# Altium schematic sheet sheet3.SchDoc
size A3
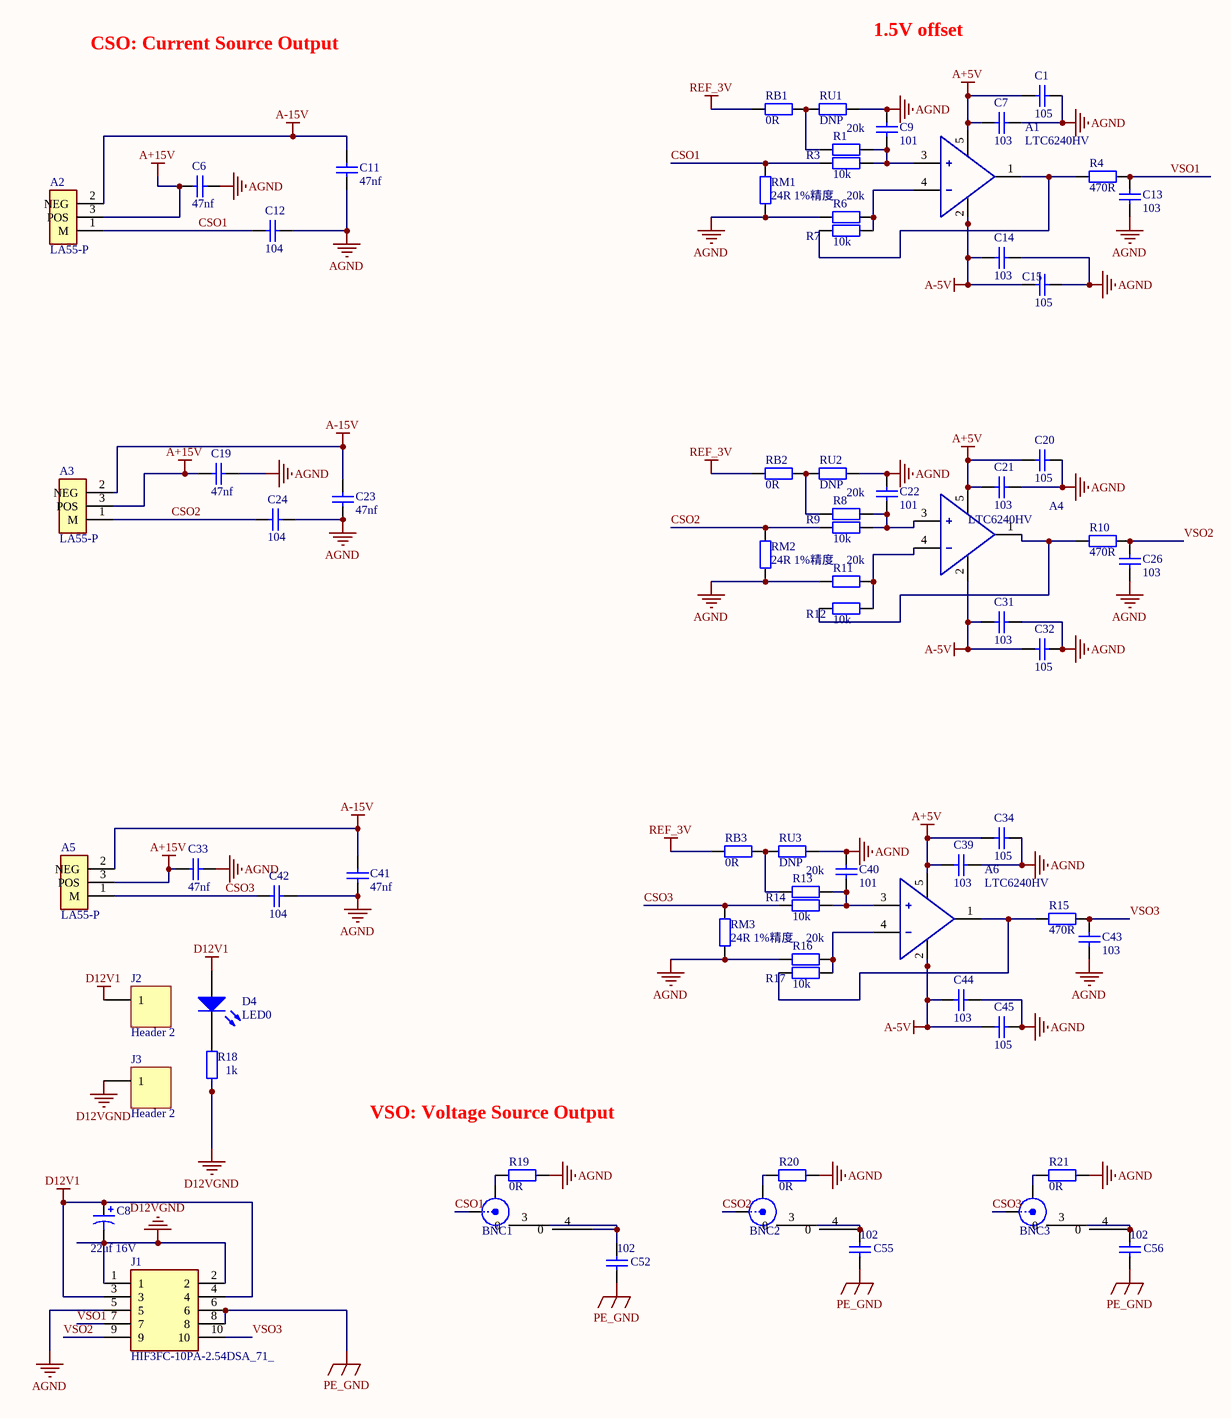
[diagram p0: sheet3.SchDoc]

## Parts
A1  LTC6240HV  [SOT95P280X100-5N]
A2  LA55-P  [XDCR_LA55-P]
A3  LA55-P  [XDCR_LA55-P]
A4  LTC6240HV  [SOT95P280X100-5N]
A5  LA55-P  [XDCR_LA55-P]
A6  LTC6240HV  [SOT95P280X100-5N]
BNC1  BNC  [BNC]  (value not drawn)
BNC2  BNC  [BNC]  (value not drawn)
BNC3  BNC  [BNC]  (value not drawn)
C1  105  [0805]
C6  47nf  [0805]
C7  103  [0805]
C8  22uf 16V  [1206 (钽电容)]
C9  101  [0805]
C11  47nf  [0805]
C12  104  [0805]
C13  103  [0805]
C14  103  [0805]
C15  105  [0805]
C19  47nf  [0805]
C20  105  [0805]
C21  103  [0805]
C22  101  [0805]
C23  47nf  [0805]
C24  104  [0805]
C26  103  [0805]
C31  103  [0805]
C32  105  [0805]
C33  47nf  [0805]
C34  105  [0805]
C39  103  [0805]
C40  101  [0805]
C41  47nf  [0805]
C42  104  [0805]
C43  103  [0805]
C44  103  [0805]
C45  105  [0805]
C52  102  [0805]
C55  102  [0805]
C56  102  [0805]
D4  LED0  [l0805]
J1  HIF3FC-10PA-2.54DSA_71_  [SHDR10W50P254_2X5_2020X850X920P]
J2  Header 2  [接地柱M3]
J3  Header 2  [接地柱M3]
R1  20k  [0805]
R3  10k  [0805]
R4  470R  [0805]
R6  20k  [0805]
R7  10k  [0805]
R8  20k  [0805]
R9  10k  [0805]
R10  470R  [0805]
R11  20k  [0805]
R12  10k  [0805]
R13  20k  [0805]
R14  10k  [0805]
R15  470R  [0805]
R16  20k  [0805]
R17  10k  [0805]
R18  1k  [0805]
R19  0R  [0805]
R20  0R  [0805]
R21  0R  [0805]
RB1  0R  [0805]
RB2  0R  [0805]
RB3  0R  [0805]
RM1  24R 1%精度  [2512]
RM2  24R 1%精度  [2512]
RM3  24R 1%精度  [2512]
RU1  DNP  [0805]
RU2  DNP  [0805]
RU3  DNP  [0805]

## Nets
A+5V: A1.5(Vcc) A4.5(Vcc) A6.5(Vcc) C1.2 C7.2 C20.2 C21.2 C34.2 C39.2
A+15V: A2.3(POS) A3.3(POS) A5.3(POS) C6.2 C19.2 C33.2
A-5V: A1.2(Vee) A4.2(Vee) A6.2(Vee) C14.2 C15.2 C31.2 C32.2 C44.2 C45.2
A-15V: A2.2(NEG) A3.2(NEG) A5.2(NEG) C11.2 C23.1 C41.1
AGND: C1.1 C6.1 C7.1 C9.2 C11.1 C12.2 C13.1 C14.1 C15.1 C19.1 C20.1 C21.1 C22.2 C23.2 C24.2 C26.1 C31.1 C32.1 C33.1 C34.1 C39.1 C40.2 C41.2 C42.2 C43.1 C44.1 C45.1 J1.5 R6.1 R11.1 R16.1 R19.1 R20.1 R21.1 RM1.2 RM2.2 RM3.2 RU1.2 RU2.2 RU3.2
D12V1: C8.1 D4.1(A) J1.3 J1.4 J2.1
D12VGND: C8.2 J1.1 J1.2 J3.1 R18.1
PE_GND: C52.2 C55.2 C56.2 J1.6 J1.8
REF_3V: RB1.1 RB2.1 RB3.1
CSO1: A2.1(M) BNC1.1(X) C12.1 R3.1 RM1.1
CSO2: A3.1(M) BNC2.1(X) C24.1 R9.1 RM2.1
CSO3: A5.1(M) BNC3.1(X) C42.1 R14.1 RM3.1
VSO1: C13.2 J1.7 R4.1
VSO2: C26.2 J1.9 R10.1
VSO3: C43.2 J1.10 R15.1
NetA1_1: A1.1(out) R4.2 R7.1
NetA1_3: A1.3(+IN) C9.1 R1.2 R3.2
NetA1_4: A1.4(-IN) R6.2 R7.2
NetA4_1: A4.1(out) R10.2 R12.1
NetA4_3: A4.3(+IN) C22.1 R8.2 R9.2
NetA4_4: A4.4(-IN) R11.2 R12.2
NetA6_1: A6.1(out) R15.2 R17.1
NetA6_3: A6.3(+IN) C40.1 R13.2 R14.2
NetA6_4: A6.4(-IN) R16.2 R17.2
NetBNC1_2: BNC1.2(Y) R19.2
NetBNC1_3: BNC1.3(0) BNC1.4(0) C52.1
NetBNC2_2: BNC2.2(Y) R20.2
NetBNC2_3: BNC2.3(0) BNC2.4(0) C55.1
NetBNC3_2: BNC3.2(Y) R21.2
NetBNC3_3: BNC3.3(0) BNC3.4(0) C56.1
NetD4_2: D4.2(K) R18.2
NetR1_1: R1.1 RB1.2 RU1.1
NetR8_1: R8.1 RB2.2 RU2.1
NetR13_1: R13.1 RB3.2 RU3.1

## Notes on the sheet
- CSO: Current Source Output
- 1.5V offset
- VSO: Voltage Source Output

## Library data of the parts
A1 A4 A6 = AO_LTC6240HV: OP AMP, +-5.5V, 18MHZ, 10V/US, 5TSOT23; Produttore: LINEAR TECHNOLOGY; Codice produttore: LTC6240HVHS5#PBF; Classe: IC; Farnell #: 2294747; Package: sot23-5
A2 A3 A5 = LA55-P: Current Sensor 50A 1 Channel Hall Effect, Closed Loop Bidirectional Module, Single Pass Through; MF: LEM USA; MP: LA 55-P; Availability: Unavailable; SnapEDA_Link: https://www.snapeda.com/parts/LA%2055-P/LEM%20USA%20Inc./view-part/38924/?ref=snap; Value: *; Package: Module LEM USA; Price: None
BNC1-BNC3 = BNC: BNC Elbow Connector; LatestRevisionDate: 17-Jul-2002; LatestRevisionNote: Re-released for DXP Platform.; Publisher: Altium Limited
C1 C7 C13-C15 C20 C21 C26 C31 C32 C34 C39 C43-C45 = Cap: Capacitor; Value: 101; Published: 8-Jun-2000; LatestRevisionDate: 17-Jul-2002; LatestRevisionNote: Re-released for DXP Platform.; PackageReference: RAD-0.3; Publisher: Altium Limited
C6 C11 C12 C19 C23 C24 C33 C41 C42 C52 C55 C56 = Cap Semi: Capacitor (Semiconductor SIM Model); Published: 8-Jun-2000; LatestRevisionDate: 17-Jul-2002; LatestRevisionNote: Re-released for DXP Platform.; PackageReference: C1206; Publisher: Altium Limited
C8 = Cap Pol1: Polarized Capacitor (Radial); Published: 8-Jun-2000; LatestRevisionDate: 17-Jul-2002; LatestRevisionNote: Re-released for DXP Platform.; Publisher: Altium Limited
C9 C22 C40 = Cap: Capacitor; Published: 8-Jun-2000; LatestRevisionDate: 17-Jul-2002; LatestRevisionNote: Re-released for DXP Platform.; PackageReference: RAD-0.3; Publisher: Altium Limited; Value: 101
D4 = LED0: Typical INFRARED GaAs LED; Published: 8-Jun-2000; LatestRevisionDate: 08-Jul-2005; LatestRevisionNote: Mech Layer 1 removed.; PackageReference: LED-0; Publisher: Altium Limited; PackageDescription: LED; 2 Leads
J1 = HIF3FC-10PA-2.54DSA_71_: Connector; Manufacturer_Name: Hirose; Manufacturer_Part_Number: HIF3FC-10PA-2.54DSA(71); Datasheet Link: https://componentsearchengine.com/Datasheets/1/HIF3FC-10PA-2.54DSA(71).pdf; Height: 9.2mm; Mouser Part Number: 798-HIF3FC10PA254D71; Mouser Price/Stock: https://www.mouser.co.uk/ProductDetail/Hirose-Connector/HIF3FC-10PA-2.54DSA71?qs=eDUdFcBPps26f2LJxn%252B8VA%3D%3D
J2 J3 = Header 2_1: Header, 2-Pin; LatestRevisionDate: 17-Jul-2002; LatestRevisionNote: Re-released for DXP Platform.; Publisher: Altium Limited
R1 R6 R8 R11 R13 R16 R19-R21 RB1-RB3 RU1-RU3 = Res2: Resistor; Value: 10K; Published: 8-Jun-2000; LatestRevisionDate: 17-Jul-2002; LatestRevisionNote: Re-released for DXP Platform.; PackageReference: AXIAL-0.4; Publisher: Altium Limited
R3 R4 R7 R9 R10 R12 R14 R15 R17 R18 = Res2: Resistor; Published: 8-Jun-2000; LatestRevisionDate: 17-Jul-2002; LatestRevisionNote: Re-released for DXP Platform.; PackageReference: AXIAL-0.4; Publisher: Altium Limited
  R3 R7 R9 R12 R14 R17: Value: 10K
  R4 R10 R15: Value: 470R
  R18: PackageDescription: Axial Device, Thru-Hole; 2 Leads; 0.4 in Pin Spacing; Value: 1K
RM1-RM3 = Res2: Resistor; Value: 3.3K; Published: 8-Jun-2000; LatestRevisionDate: 17-Jul-2002; LatestRevisionNote: Re-released for DXP Platform.; PackageReference: AXIAL-0.4; Publisher: Altium Limited; PackageDescription: Axial Device, Thru-Hole; 2 Leads; 0.4 in Pin Spacing